# EAGLE schematic GeoSigfox (EAGLE 9.0.0)
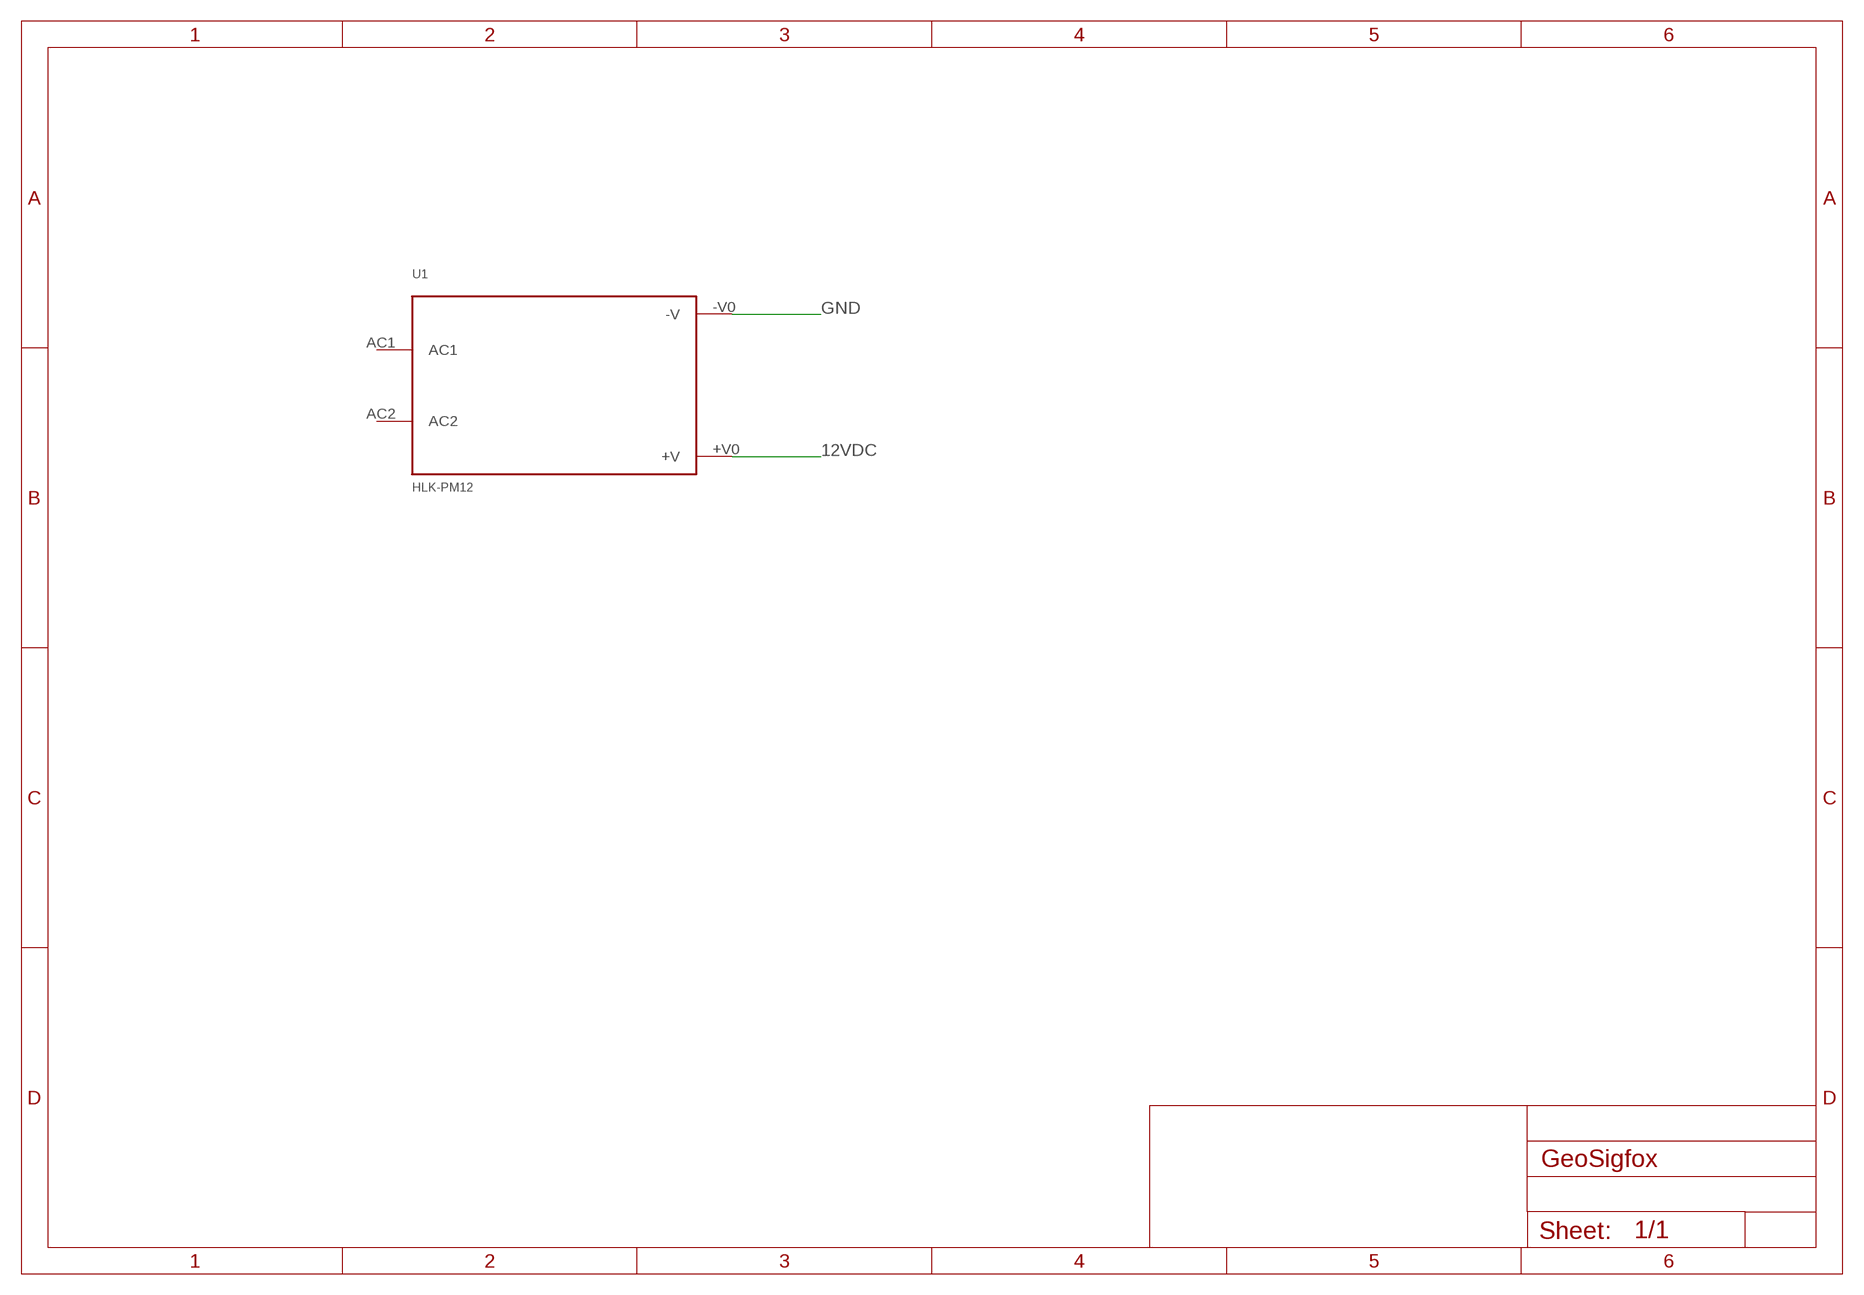
[diagram p0: schematic, sheet 1]

## Parts
U1  HLK-PM12  [HLK-PM12]

## Nets
12VDC: U1.+V0(+V)
GND: U1.-V0(-V)

## Power pins joined to a net without a drawn wire
AC1: U1.AC1
AC2: U1.AC2

## Library data of the parts
U1 = myLibrary:HLK-PM12: HLK-PM12 Ultra-compact module power